# Altium schematic sheet OMD_LEDS.SchDoc
size A0; Organization: Altium Limited; Address1: L3, 12a Rodborough Rd; Address2: Frenchs Forest; Address3: NSW; Address4: Australia 2086
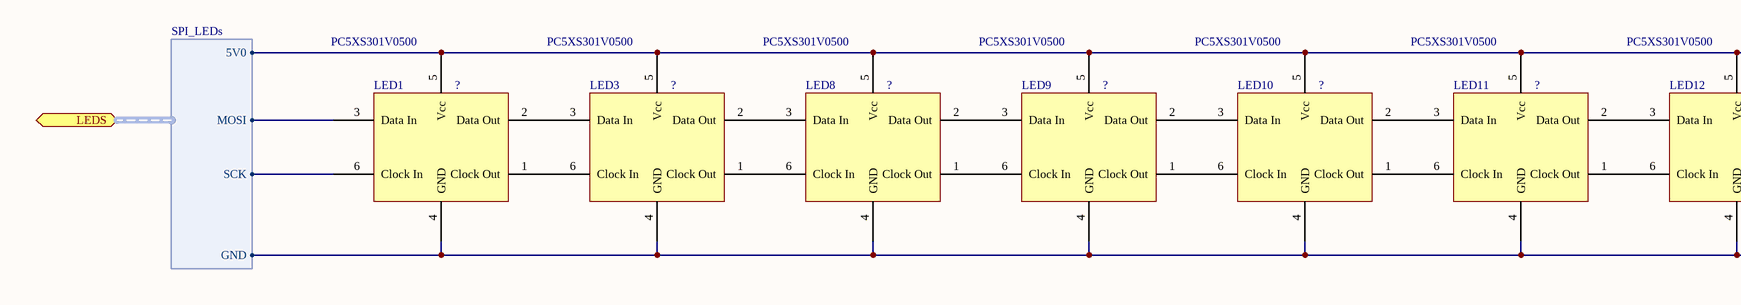
[diagram p0: OMD_LEDS.SchDoc, left]
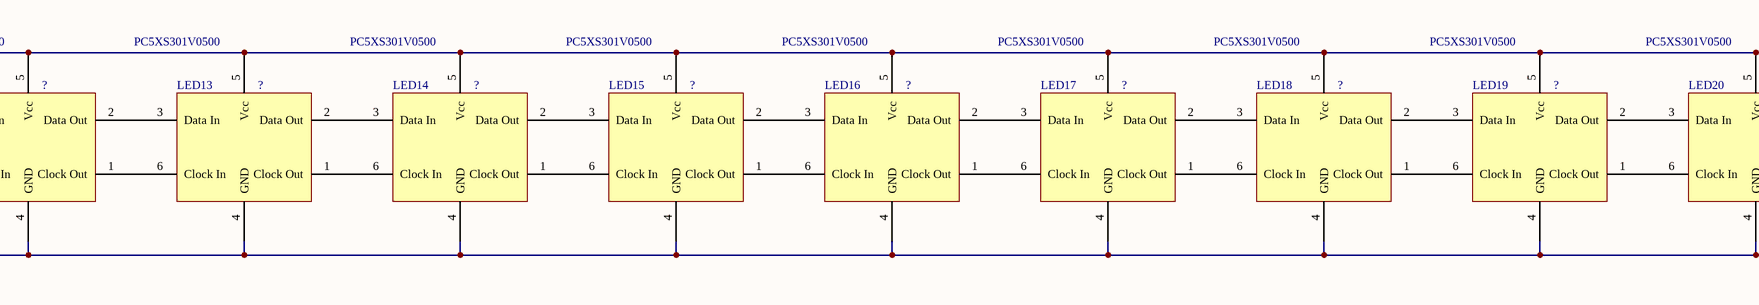
[diagram p1: OMD_LEDS.SchDoc, middle]
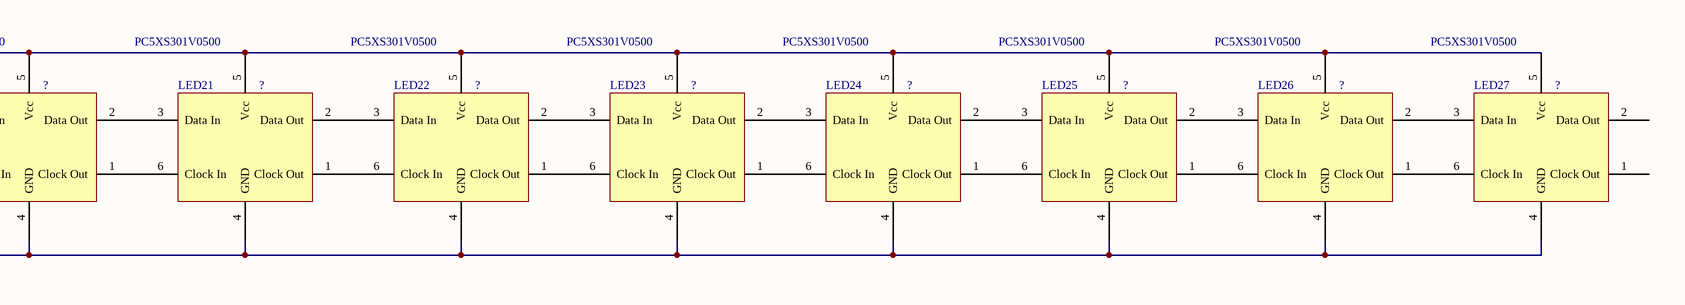
[diagram p2: OMD_LEDS.SchDoc, right]

## Parts
LED1  ?  Supplier Part Number 1: PC5XS301V0500  [UBLED]
LED3  ?  Supplier Part Number 1: PC5XS301V0500  [UBLED]
LED8  ?  Supplier Part Number 1: PC5XS301V0500  [UBLED]
LED9  ?  Supplier Part Number 1: PC5XS301V0500  [UBLED]
LED10  ?  Supplier Part Number 1: PC5XS301V0500  [UBLED]
LED11  ?  Supplier Part Number 1: PC5XS301V0500  [UBLED]
LED12  ?  Supplier Part Number 1: PC5XS301V0500  [UBLED]
LED13  ?  Supplier Part Number 1: PC5XS301V0500  [UBLED]
LED14  ?  Supplier Part Number 1: PC5XS301V0500  [UBLED]
LED15  ?  Supplier Part Number 1: PC5XS301V0500  [UBLED]
LED16  ?  Supplier Part Number 1: PC5XS301V0500  [UBLED]
LED17  ?  Supplier Part Number 1: PC5XS301V0500  [UBLED]
LED18  ?  Supplier Part Number 1: PC5XS301V0500  [UBLED]
LED19  ?  Supplier Part Number 1: PC5XS301V0500  [UBLED]
LED20  ?  Supplier Part Number 1: PC5XS301V0500  [UBLED]
LED21  ?  Supplier Part Number 1: PC5XS301V0500  [UBLED]
LED22  ?  Supplier Part Number 1: PC5XS301V0500  [UBLED]
LED23  ?  Supplier Part Number 1: PC5XS301V0500  [UBLED]
LED24  ?  Supplier Part Number 1: PC5XS301V0500  [UBLED]
LED25  ?  Supplier Part Number 1: PC5XS301V0500  [UBLED]
LED26  ?  Supplier Part Number 1: PC5XS301V0500  [UBLED]
LED27  ?  Supplier Part Number 1: PC5XS301V0500  [UBLED]

## Ports
LEDS (harness SPI_LEDs)

## Harnesses
SPI_LEDs: SCK, MOSI, 5V0, GND

## Nets
NetLED1_1: LED1.1(Clock_Out) LED3.6(Clock_In)
NetLED1_2: LED1.2(Data_Out) LED3.3(Data_In)
NetLED1_3: LED1.3(Data_In) ; port LEDS.MOSI
NetLED1_4: LED1.4(GND) LED3.4(GND) LED8.4(GND) LED9.4(GND) LED10.4(GND) LED11.4(GND) LED12.4(GND) LED13.4(GND) LED14.4(GND) LED15.4(GND) LED16.4(GND) LED17.4(GND) LED18.4(GND) LED19.4(GND) LED20.4(GND) LED21.4(GND) LED22.4(GND) LED23.4(GND) LED24.4(GND) LED25.4(GND) LED26.4(GND) LED27.4(GND) ; port LEDS.GND
NetLED1_5: LED1.5(Vcc) LED3.5(Vcc) LED8.5(Vcc) LED9.5(Vcc) LED10.5(Vcc) LED11.5(Vcc) LED12.5(Vcc) LED13.5(Vcc) LED14.5(Vcc) LED15.5(Vcc) LED16.5(Vcc) LED17.5(Vcc) LED18.5(Vcc) LED19.5(Vcc) LED20.5(Vcc) LED21.5(Vcc) LED22.5(Vcc) LED23.5(Vcc) LED24.5(Vcc) LED25.5(Vcc) LED26.5(Vcc) LED27.5(Vcc) ; port LEDS.5V0
NetLED1_6: LED1.6(Clock_In) ; port LEDS.SCK
NetLED3_1: LED3.1(Clock_Out) LED8.6(Clock_In)
NetLED3_2: LED3.2(Data_Out) LED8.3(Data_In)
NetLED8_1: LED8.1(Clock_Out) LED9.6(Clock_In)
NetLED8_2: LED8.2(Data_Out) LED9.3(Data_In)
NetLED9_1: LED9.1(Clock_Out) LED10.6(Clock_In)
NetLED9_2: LED9.2(Data_Out) LED10.3(Data_In)
NetLED10_1: LED10.1(Clock_Out) LED11.6(Clock_In)
NetLED10_2: LED10.2(Data_Out) LED11.3(Data_In)
NetLED11_1: LED11.1(Clock_Out) LED12.6(Clock_In)
NetLED11_2: LED11.2(Data_Out) LED12.3(Data_In)
NetLED12_1: LED12.1(Clock_Out) LED13.6(Clock_In)
NetLED12_2: LED12.2(Data_Out) LED13.3(Data_In)
NetLED13_1: LED13.1(Clock_Out) LED14.6(Clock_In)
NetLED13_2: LED13.2(Data_Out) LED14.3(Data_In)
NetLED14_1: LED14.1(Clock_Out) LED15.6(Clock_In)
NetLED14_2: LED14.2(Data_Out) LED15.3(Data_In)
NetLED15_1: LED15.1(Clock_Out) LED16.6(Clock_In)
NetLED15_2: LED15.2(Data_Out) LED16.3(Data_In)
NetLED16_1: LED16.1(Clock_Out) LED17.6(Clock_In)
NetLED16_2: LED16.2(Data_Out) LED17.3(Data_In)
NetLED17_1: LED17.1(Clock_Out) LED18.6(Clock_In)
NetLED17_2: LED17.2(Data_Out) LED18.3(Data_In)
NetLED18_1: LED18.1(Clock_Out) LED19.6(Clock_In)
NetLED18_2: LED18.2(Data_Out) LED19.3(Data_In)
NetLED19_1: LED19.1(Clock_Out) LED20.6(Clock_In)
NetLED19_2: LED19.2(Data_Out) LED20.3(Data_In)
NetLED20_1: LED20.1(Clock_Out) LED21.6(Clock_In)
NetLED20_2: LED20.2(Data_Out) LED21.3(Data_In)
NetLED21_1: LED21.1(Clock_Out) LED22.6(Clock_In)
NetLED21_2: LED21.2(Data_Out) LED22.3(Data_In)
NetLED22_1: LED22.1(Clock_Out) LED23.6(Clock_In)
NetLED22_2: LED22.2(Data_Out) LED23.3(Data_In)
NetLED23_1: LED23.1(Clock_Out) LED24.6(Clock_In)
NetLED23_2: LED23.2(Data_Out) LED24.3(Data_In)
NetLED24_1: LED24.1(Clock_Out) LED25.6(Clock_In)
NetLED24_2: LED24.2(Data_Out) LED25.3(Data_In)
NetLED25_1: LED25.1(Clock_Out) LED26.6(Clock_In)
NetLED25_2: LED25.2(Data_Out) LED26.3(Data_In)
NetLED26_1: LED26.1(Clock_Out) LED27.6(Clock_In)
NetLED26_2: LED26.2(Data_Out) LED27.3(Data_In)

Not connected (* = marked no-connect by the designer): LED27 1(Clock_Out) 2(Data_Out)

## Notes on the sheet
- https://github.com/OpenMotorDrive
- Title
- ProfiCNC Pty. Ltd.
- https://creativecommons.org/licenses/by-nc-sa/4.0/
- For Commercial use, please contact ProfiCNC
- ProfiCNC does NOT guaranty these drawings as fit for any purpose, you must verify this information before attempting to use it in any way.  USE AT OWN RISK
- Size:
- Date:
- File:
- A0
- Number:
- Time:
- Revision:
- Sheet
- of

## Library data of the parts
LED1 LED3 LED8-LED27 = UBLED: Supplier 1: jeff_chang@ubleds.com.tw